# EAGLE design shinobi_grideye (EAGLE 8.2.2)
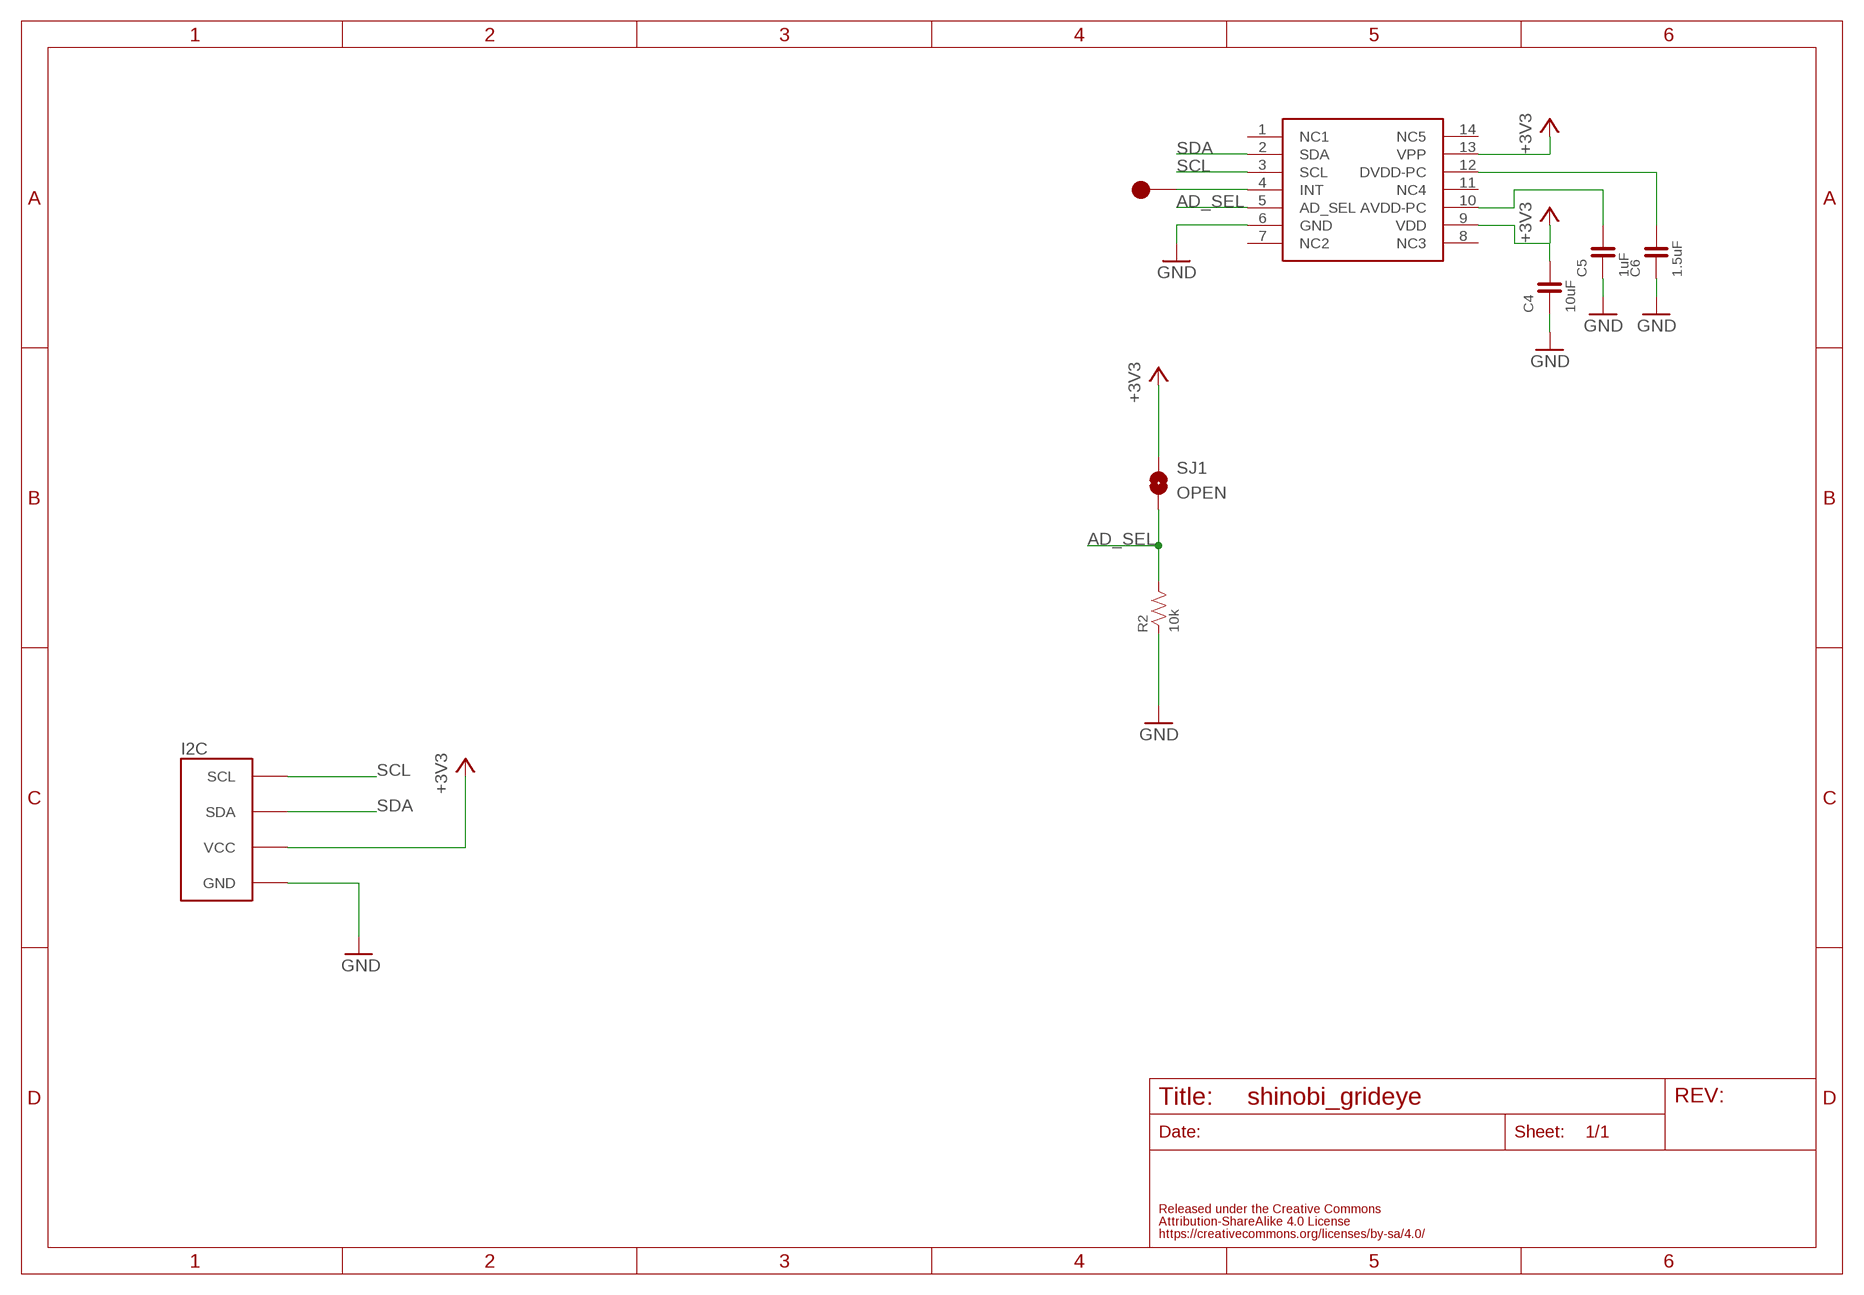
[diagram p0: schematic, sheet 1]

## Parts
C4  10uF  CAPACITOR-0603  [0603]
C5  1uF  CAPACITOR-0603  [0603]
C6  1.5uF  CAPACITOR-0603  [0603]
GRIDEYE  PN-AMG8331  [PANASONIC-AMG8831]
I2C  FABO_BRICK_I2C-S04B-PASK-2_LONG  [FABO_BRICK_I2C_S04B-PASK-2_LONG]
INT  INT  TP-15  [TP-15]
R2  10k  RESISTOR-0603  [0603]
SJ1  OPEN  SMD-JUMPER-2-OPEN  [SMD-JUMPER-2-OPEN]

## Nets
+3V3: C4.2 GRIDEYE.9(VDD) GRIDEYE.13(VPP) I2C.VCC SJ1.1
AD_SEL: GRIDEYE.5(AD_SEL) R2.2 SJ1.2
GND: C4.1 C5.1 C6.1 GRIDEYE.6(GND) I2C.GND R2.1
N$2: GRIDEYE.4(INT) INT.1
N$5: C6.2 GRIDEYE.12(DVDD-PC)
N$6: C5.2 GRIDEYE.10(AVDD-PC)
SCL: GRIDEYE.3(SCL) I2C.SCL
SDA: GRIDEYE.2(SDA) I2C.SDA
Unconnected: GRIDEYE.1(NC1) GRIDEYE.7(NC2) GRIDEYE.8(NC3) GRIDEYE.11(NC4) GRIDEYE.14(NC5)

## Library data of the parts
C4-C6 = FaBo-Capacitor:CAPACITOR: CAPACITOR
GRIDEYE = FaBo-Mems:PN-AMG8331
I2C = FaBo-Template:FABO_BRICK_I2C: FaBo Brick I2C
INT = FaBo-Supply:TP
R2 = FaBo-Resistors:RESISTOR: RESISTOR
SJ1 = FaBo-Supply:SMD-JUMPER-2

## Board
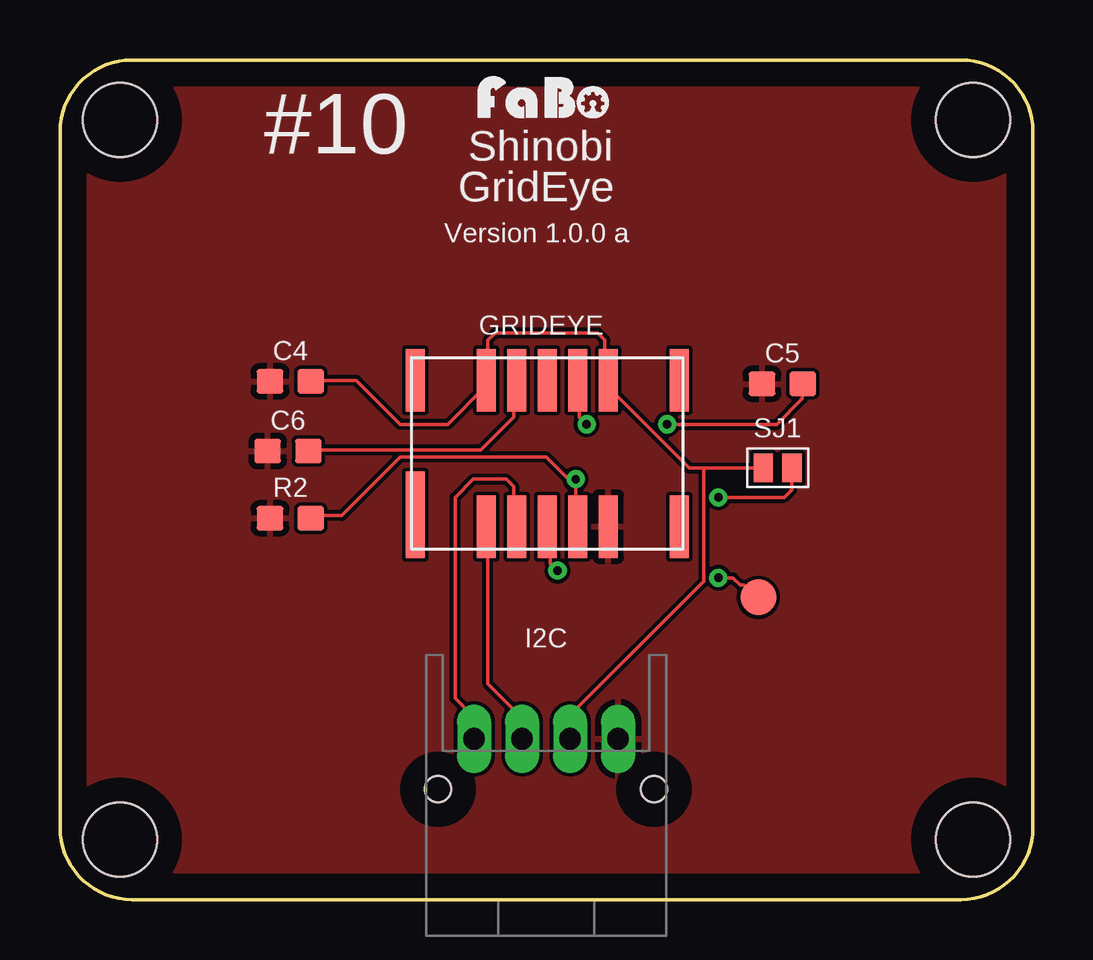
[diagram p1: board, top side]
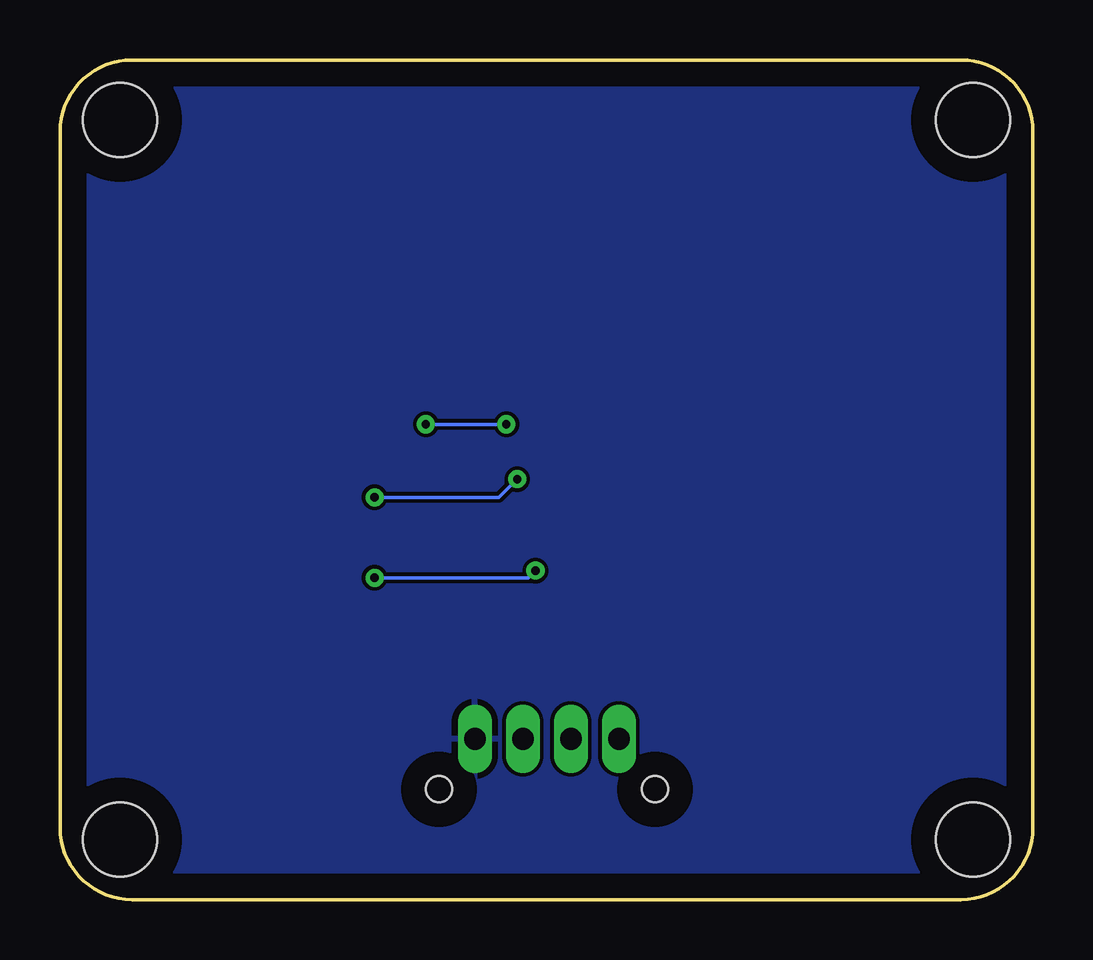
[diagram p2: board, bottom side, seen from below]

Size 40.54 x 35 mm. Coordinates in mm from the lower left corner, seen from the top.
Copper layers (1*16): Top 0.035mm / dielectric 1.5mm / Bottom 0.035mm
Design rules "default": minimum track width 6mil, minimum drill 0.35mm, track to track 6mil, track to pad 6mil, pad to pad 6mil, via to via 6mil, smd to smd 6mil, copper to edge 40mil, drill to drill 6mil, minimum pad ring 10mil, minimum via ring 8mil, stop-mask expansion 4mil, vias tented up to drill 0mil, thermal gap 10mil

### Footprints (pad centres in the part's own frame; a part is rotated, then mirrored left to right if it is on the bottom)
0603 = smd 1.1 x 1: 1 -0.85,0; 2 0.85,0
PANASONIC-AMG8831 = smd 0.8 x 3.6: 1 -5.5,-2.55 | smd 0.8 x 2.6: 2 -2.54,-3.05; 3 -1.27,-3.05; 4 0,-3.05; 5 1.27,-3.05; 6 2.54,-3.05; 7 5.5,-3.05; 8 5.5,3.05; 9 2.54,3.05; 10 1.27,3.05; 11 0,3.05; 12 -1.27,3.05; 13 -2.54,3.05; 14 -5.5,3.05
FABO_BRICK_I2C_S04B-PASK-2_LONG = drill 0.9 pad 1.422 long: GND -3,0; SCL 3,0; SDA 1,0; VCC -1,0 | hole 1.1: 4.5,2.1; -4.5,2.1
TP-15 = smd 1.5 x 1.5: 1 0,0
SMD-JUMPER-2-OPEN = smd 0.8 x 1.2: 1 -0.6,0; 2 0.6,0
FABO-SHINOBI = hole 3.1: 2.5,32.5; 38.04,32.5; 38.04,2.5; 2.5,2.5

### Placement (x,y rotation side)
C4  9.6,21.6 0 top
C5  30.1,21.5 0 top
C6  9.5,18.7 0 top
GRIDEYE  20.3,18.6 0 top
I2C  20.25,6.7 180 top
INT  29.1,12.6 0 top
R2  9.6,15.9 0 top
SJ1  29.9,18 0 top
U$2  [LOGO_FABO_S]  20.2,32.42 0 top
U$3  [FABO-SHINOBI]  0,0 0 top

### Tracks (layer width: path | path; a pad name or v marks a point on that pad's centre or on a via)
+3V3
  Top 0.152: C4.2 10.52,21.64 12.34,21.64 14.17,19.81 16.15,19.81 17.68,21.34 17.68,21.64 GRIDEYE.13 17.83,21.79 17.83,23.32 18.14,23.62 22.4,23.62 22.71,23.32 22.71,21.79 GRIDEYE.9 22.86,21.64 22.86,21.34 26.21,17.98 26.82,17.98 | 26.82,17.98 29.26,17.98 SJ1.1 | 26.82,17.98 26.82,13.26 21.34,7.77 21.34,6.71 I2C.VCC
AD_SEL  (via drill 0.35)
  Top 0.152: 21.34,17.37 21.49,17.22 21.49,15.7 GRIDEYE.5 | 21.34,17.37 20.27,18.44 14.17,18.44 11.73,16 10.52,16 R2.2 | v27.43,16.76 30.18,16.76 30.48,17.07 30.48,17.98 SJ1.2 | 21.34,17.37 v21.49,17.53
  Bottom 0.152: v27.43,16.76 22.25,16.76 v21.49,17.53
GND
  pour Top: 0,0 41,0 41,35 0,35
  pour Bottom: 0,0 41,0 41,35 0,35
N$2  (via drill 0.35)
  Top 0.152: v27.43,13.41 28.04,13.41 28.35,13.11 28.5,13.11 28.96,12.65 INT.1 | v20.73,13.72 20.42,14.02 20.42,15.54 GRIDEYE.4
  Bottom 0.152: v27.43,13.41 21.03,13.41 v20.73,13.72
N$5
  Top 0.152: C6.2 10.36,18.75 17.53,18.75 18.9,20.12 18.9,21.64 GRIDEYE.12
N$6  (via drill 0.35)
  Top 0.152: v25.3,19.81 29.87,19.81 30.94,20.88 30.94,21.49 C5.2 | v21.95,19.81 21.64,20.12 21.64,21.64 GRIDEYE.10
  Bottom 0.152: v21.95,19.81 v25.3,19.81
SCL
  Top 0.152: GRIDEYE.3 18.9,15.7 18.9,17.22 18.59,17.53 17.22,17.53 16.46,16.76 16.46,8.38 17.22,7.62 17.22,6.71 I2C.SCL
SDA
  Top 0.152: GRIDEYE.2 17.83,15.54 17.83,8.99 19.2,7.62 19.2,6.71 I2C.SDA

### Text on the board
tPlace: #10 | Shinobi | GridEye | Version 1.0.0 a